# Altium schematic sheet FMC_EEPROM.SchDoc: FMC 5GS/s ADC/TDC
size 420 x 297 mm; Author: Agnieszka Bartkowicz; CompanyName: WUT ISE; DrawnBy: Agnieszka Bartkowicz; Engineer: Agnieszka Bartkowicz; Organization: WUT ISE; Address1: PW ISE; Address2: Nowowiejska 15/19 00-665 Warsaw; Address3: gyorka@o2.pl; SheetNumber: 12; SheetTotal: 13; ModifiedBy: -; CheckedDate: -; Title2: Title 2; DivGrp: WUT ISE; Designer: A. Bartkowicz
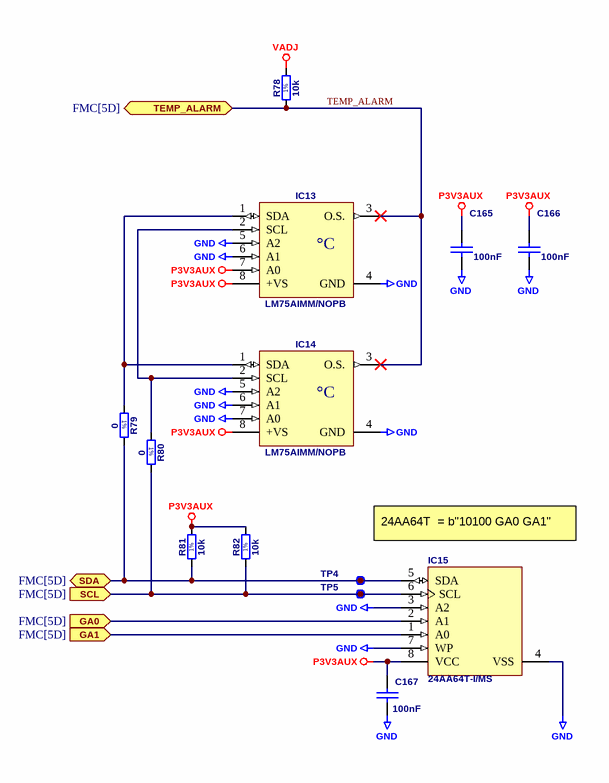
[diagram p0: FMC_EEPROM.SchDoc]

## Parts
C165  100nF  [CAPC0603X33N]
C166  100nF  [CAPC0603X33N]
C167  100nF  [CAPC0603X33N]
IC13  LM75AIMM/NOPB  [SOP65P490X109-8N]
IC14  LM75AIMM/NOPB  [SOP65P490X109-8N]
IC15  24AA64T-I/MS  [SOP65P490X110-8N]
R78  10k  [RESC1005X40N]
R79  0  [RESC1005X40N]
R80  0  [RESC1005X40N]
R81  10k  [RESC1005X40N]
R82  10k  [RESC1005X40N]
TP4  SMD Pad  [C100]  (value not drawn)
TP5  SMD Pad  [C100]  (value not drawn)

## Ports
GA0 (in, see FMC[5D]), GA1 (in, see FMC[5D]), SCL (in, see FMC[5D]), SDA (bidir, see FMC[5D]), TEMP_ALARM (bidir, see FMC[5D])

## Nets
GND: C165.2 C166.2 C167.2 IC13.4(GND) IC13.5(A2) IC13.6(A1) IC14.4(GND) IC14.5(A2) IC14.6(A1) IC14.7(A0) IC15.3(A2) IC15.4(VSS) IC15.7(WP)
P3V3AUX: C165.1 C166.1 C167.1 IC13.7(A0) IC13.8(+VS) IC14.8(+VS) IC15.8(VCC) R81.2 R82.2
VADJ: R78.2
GA0: IC15.2(A1) ; port GA0
GA1: IC15.1(A0) ; port GA1
SCL: IC15.6(SCL) R80.2 R82.1 TP5.1 ; port SCL
SDA: IC15.5(SDA) R79.2 R81.1 TP4.1 ; port SDA
TEMP_ALARM: IC13.3(O.S.) IC14.3(O.S.) R78.1 ; port TEMP_ALARM
NetIC13_1: IC13.1(SDA) IC14.1(SDA) R79.1
NetIC13_2: IC13.2(SCL) IC14.2(SCL) R80.1

## Notes on the sheet
- 24AA64T  = b"10100 GA0 GA1"
- Project/Equipment
- Document
- Designer
- Drawn by
- Check.by
- Copyright WUT ISE 2024.
  This documentation describes Open Hardware and is licensed under the CERN OHL v.2. You may redistribute and modify this documentation under the terms of the CERN OHL v.2. (http://ohwr.org/CERNOHL). This documentation is distributed WITHOUT ANY EXPRESS OR IMPLIED WARRANTY, INCLUDING OF MERCHANTABILITY, SATISFACTORY QUALITY AND FITNESS FOR A PARTICULAR PURPOSE. Please see the CERN OHL v.2 for applicable conditions.
- Contact
- File
- Last Mod.
- Print Date
- Sheet
- Size
- A3
- of
- Rev
- (in symbol LM75AIMM/NOPB) °C
- (in symbol R0402_0R_JUMPER) 1%
- (in symbol R0402_10K_1%_0.0625W_100PPM) 1%

## Library data of the parts
C165-C167 = CC0201_100NF_6.3V_10%_X5R: Non-polarised capacitor; Part Description: SMD Multilayer Chip Ceramic Capacitor; Manufacturer: GENERIC; Manufacturer1 Part Number: 02016D104KAT2A; Voltage: 6.3V; TC: X5R; Tolerance: ±10%; Table: Capacitors SMD; Part Number: CC0201_100NF_6.3V_10%_X5R; Component Kind: Standard; Component Type: Standard; Pin Count: 2; Value: 100nF; Status: Not Recommended; Manufacturer Part Number: CC0201_100NF_6.3V_10%_X5R; Case: 0201; Mounted: Yes; Socket: No; SMD: Yes; Manufacturer1 Example: AVX; Manufacturer1 ComponentHeight: 0.33mm; HelpURL: \\cern.ch\dfs\Applications\Altium\Datasheets\CC0201_X5R_AVX.pdf; Author: CERN DEM JLC; CreateDate: 2007-12-03; LatestRevisionDate: 2007-12-03
IC13 IC14 = LM75AIMM/NOPB: Digital Temperature Sensor and Thermal Watchdog with Two-Wire Interface; Part Description: -25° to +100°C ±2°C Digital Temperature Sensor and Thermal Watchdog with Two-Wire Interface; Manufacturer: TEXAS INSTRUMENTS; Table: Sensors; Part Number: LM75AIMM/NOPB; Component Kind: Standard; Component Type: Standard; Device: LM75AIMM/NOPB; PackageDescription: SOP, 0.65mm pitch; 8 pin,3.00mm W X 3.00mm L X 1.09mm H bodyI, PC Medium Density; Manufacturer Part Number: LM75AIMM/NOPB; Pin Count: 8; Case: SSOP8; Mounted: Yes; Socket: No; SMD: Yes; ComponentHeight: 1.09mm; HelpURL: \\cern.ch\dfs\Applications\Altium\Datasheets\LM75AIMM-NOPB.pdf; Author: CERN DEM JLC; CreateDate: 2012-10-15; LatestRevisionDate: 2012-10-15
IC15 = 24AA64T-I/MS: 1.7V-5.5V, 64K  (8K x 8-bit) I2C Serial EEPROM; Manufacturer: MICROCHIP TECHNOLOGY; PressFit: No; Bonding: No; Part Number: 24AA64T-I/MS; Component Kind: Standard; Component Type: Standard; Device: 24AA64T-I/MS; PackageDescription: SOP, 0.65mm pitch; 8 pin, 3.00mm W X 3.00mm L X 1.10mm H body, IPC Medium Density; Part Description: 1.7V-5.5V, 64K  (8K x 8-bit) I2C Serial EEPROM; Manufacturer Part Number: 24AA64T-I/MS; Pin Count: 8; Case: MSOP8; Mounted: Yes; Socket: No; SMD: Yes; Sense: No; ComponentHeight: 1.1mm; HelpURL: \\cern.ch\dfs\Applications\Altium\Datasheets\24AA64T-I-MS.pdf; Author: CERN DEM JMW; CreateDate: 21.02.2014; LatestRevisionDate: 21.02.2014
R78 R81 R82 = R0402_10K_1%_0.0625W_100PPM: Resistor - 1%; Part Description: General Purpose Thick Film Chip Resistor; Manufacturer: GENERIC; Manufacturer1 Part Number: 232270671003L; TC: ±100ppm/°C; Table: Resistors SMD; Part Number: R0402_10K_1%_0.0625W_100PPM; Component Kind: Standard; Component Type: Standard; Pin Count: 2; Value: 10k; Status: Not recommended; Power: 0.0625W; Tolerance: ±1%; Manufacturer Part Number: R0402_10K_1%_0.0625W_100PPM; Case: 0402; Mounted: Yes; Socket: No; SMD: Yes; Manufacturer1 Example: YAGEO PHYCOMP; Manufacturer1 ComponentHeight: 0.4mm; HelpURL: \\cern.ch\dfs\Applications\Altium\Datasheets\R0402_Phycomp_RC0402.pdf; Author: CERN DEM JLC; CreateDate: 3/12/2007; LatestRevisionDate: 17/10/2012
R79 R80 = R0402_0R_JUMPER: Resistor - 1%; Part Description: 1A (0.05R Max DC Resistance) Zero Ohm Jumper; Manufacturer: GENERIC; Manufacturer1 Part Number: 232270591001; Table: Resistors SMD; Part Number: R0402_0R_JUMPER; Component Kind: Standard; Component Type: Standard; Pin Count: 2; Value: 0; Status: Not recommended; Manufacturer Part Number: R0402_0R_JUMPER; Case: 0402; Mounted: Yes; Socket: No; SMD: Yes; Manufacturer1 Example: PHYCOMP; Manufacturer1 ComponentHeight: 0.4mm; HelpURL: \\cern.ch\dfs\Applications\Altium\Datasheets\R0402_Phycomp_RC0402.pdf; Author: CERN DEM JLC; CreateDate: 2007-12-03; LatestRevisionDate: 2008-03-13
TP4 TP5 = SMD_PAD_D1MM: Through Hole Pad; Part Description: 1mm Diameter SMD Pad; Mounted: No; Part Number: SMD_PAD_D1MM; Component Kind: Standard (No BOM); Component Type: Standard (No BOM); Pin Count: 1; Family: SMD Pad; Socket: No; SMD: No; Sense: No; Status: None; ComponentHeight: 0mm; HelpURL: Undefined; Author: CERN DEM JLC; CreateDate: 10.10.2017; LatestRevisionDate: 10.10.2017; PackageDescription: 1mm Diameter SMD Pad